# EAGLE design main (EAGLE 6.6.0)
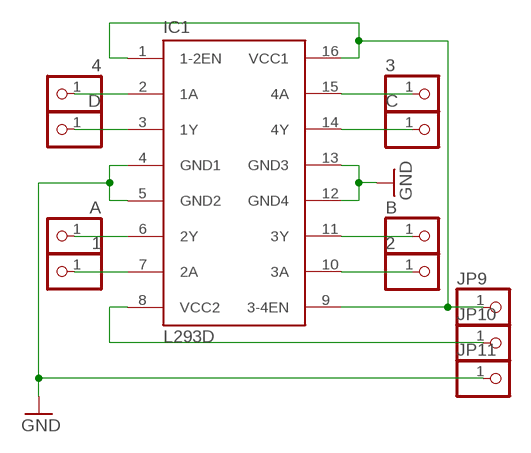
[diagram p0: schematic, sheet 1]

## Parts
1  PINHD-1X1  [1X01]
2  PINHD-1X1  [1X01]
3  PINHD-1X1  [1X01]
4  PINHD-1X1  [1X01]
A  PINHD-1X1  [1X01]
B  PINHD-1X1  [1X01]
C  PINHD-1X1  [1X01]
D  PINHD-1X1  [1X01]
IC1  L293D  [DIL16]
JP9  PINHD-1X1  [1X01]
JP10  PINHD-1X1  [1X01]
JP11  PINHD-1X1  [1X01]

## Nets
GND: IC1.4(GND1) IC1.5(GND2) IC1.12(GND4) IC1.13(GND3) JP11.1
N$1: IC1.1(1-2EN) IC1.9(3-4EN) IC1.16(VCC1) JP9.1
N$2: IC1.8(VCC2) JP10.1
N$3: 1.1 IC1.7(2A)
N$4: A.1 IC1.6(2Y)
N$5: D.1 IC1.3(1Y)
N$6: 4.1 IC1.2(1A)
N$7: 3.1 IC1.15(4A)
N$8: C.1 IC1.14(4Y)
N$9: B.1 IC1.11(3Y)
N$10: 2.1 IC1.10(3A)

## Library data of the parts
1-4 A B C D JP9-JP11 = pinhead:PINHD-1X1: PIN HEADER
IC1 = st-microelectronics:L293D: PUSH-PULL 4 CHANNEL DRIVER; MPN: L293D; OC_FARNELL: 9589619; OC_NEWARK: 56P8249

## Board
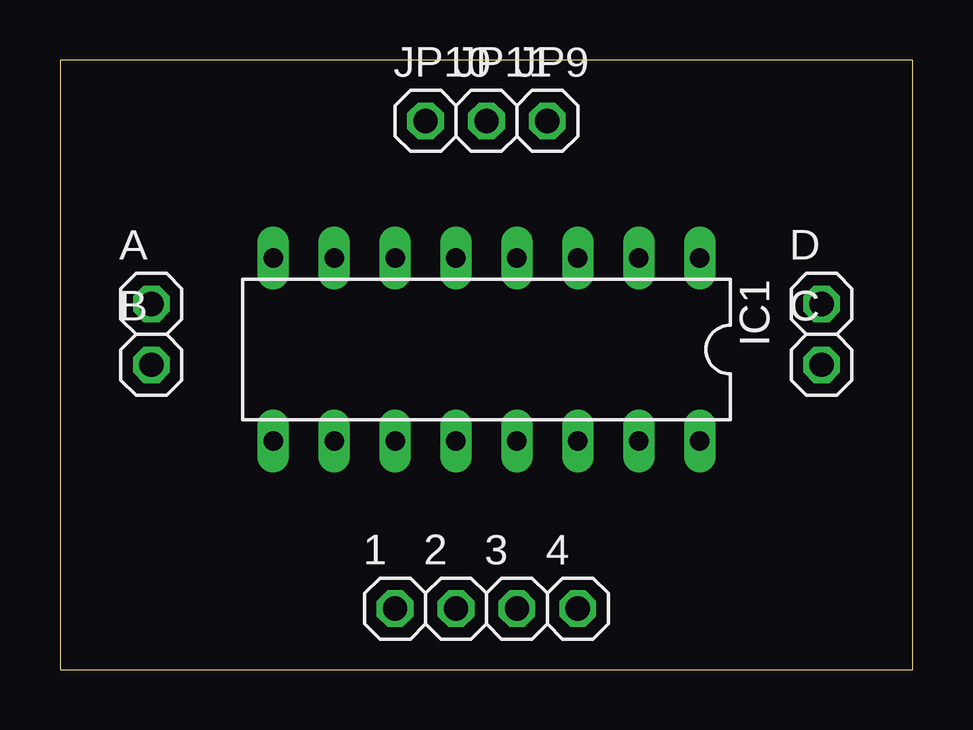
[diagram p1: board, top side]
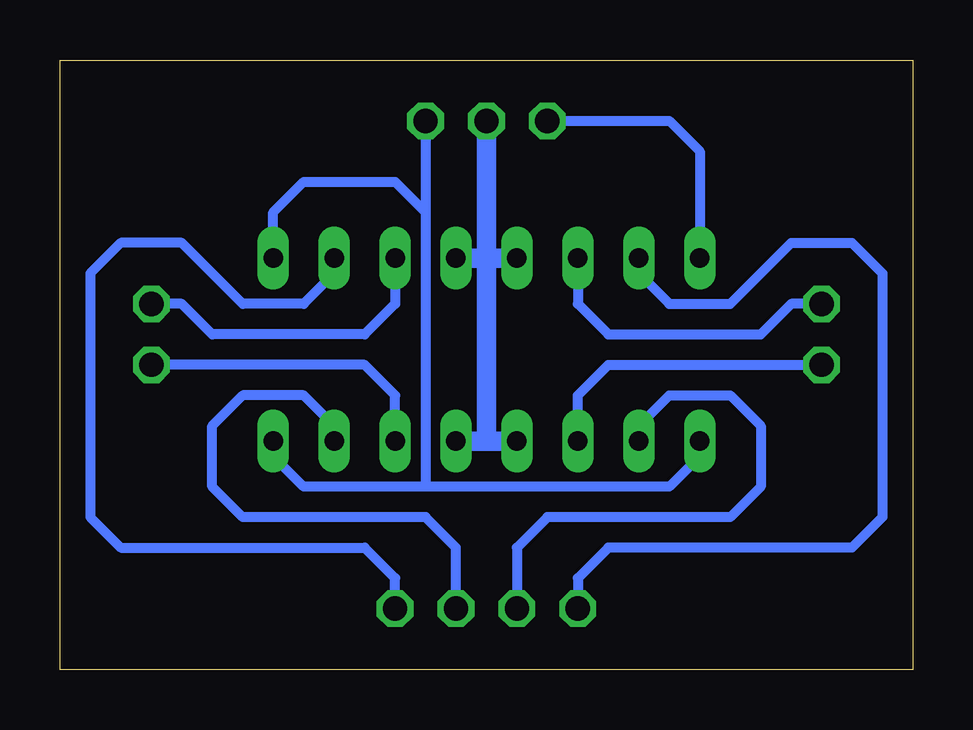
[diagram p2: board, bottom side, seen from below]

Size 35.56 x 25.4 mm. Coordinates in mm from the lower left corner, seen from the top.
Outline: 0,0 35.56,0 35.56,25.4 0,25.4 0,0
Copper layers (1*16): Top 0.035mm / dielectric 1.5mm / Bottom 0.035mm
Design rules "default": minimum track width 10mil, minimum drill 24mil, track to track 8mil, track to pad 8mil, pad to pad 8mil, via to via 8mil, smd to smd 8mil, copper to edge 40mil, drill to drill 8mil, minimum pad ring 10mil, minimum via ring 8mil, stop-mask expansion 4mil, vias tented up to drill 0mil, thermal gap 10mil

### Footprints (pad centres in the part's own frame; a part is rotated, then mirrored left to right if it is on the bottom)
1X01 = drill 1.016 octagon: 1 0,0
DIL16 = drill 0.813 long: 1 -8.89,-3.81; 2 -6.35,-3.81; 3 -3.81,-3.81; 4 -1.27,-3.81; 5 1.27,-3.81; 6 3.81,-3.81; 7 6.35,-3.81; 8 8.89,-3.81; 9 8.89,3.81; 10 6.35,3.81; 11 3.81,3.81; 12 1.27,3.81; 13 -1.27,3.81; 14 -3.81,3.81; 15 -6.35,3.81; 16 -8.89,3.81

### Placement (x,y rotation side)
1  13.97,2.54 0 top
2  16.51,2.54 0 top
3  19.05,2.54 0 top
4  21.59,2.54 0 top
A  3.81,15.24 0 top
B  3.81,12.7 0 top
C  31.75,12.7 0 top
D  31.75,15.24 0 top
IC1  17.78,13.34 180 top
JP9  20.32,22.86 0 top
JP10  15.24,22.86 0 top
JP11  17.78,22.86 0 top

### Tracks (layer width: path | path; a pad name or v marks a point on that pad's centre or on a via)
GND
  Bottom 0.813: IC1.12 17.78,9.53 | 18.41,9.53 IC1.13 17.78,9.53 | IC1.5 17.78,17.14 | 17.78,17.14 IC1.4 | 17.78,9.53 17.78,17.14 | JP11.1 17.78,17.14
N$1
  Bottom 0.406: IC1.9 8.89,8.89 10.16,7.62 20.32,7.62 | 20.32,7.62 25.4,7.62 26.67,8.89 IC1.16 | IC1.1 26.67,19.05 25.4,20.32 21.59,20.32 20.32,19.05 | 20.32,19.05 20.32,7.62 | JP9.1 20.32,19.05
N$2
  Bottom 0.406: JP10.1 10.16,22.86 8.89,21.59 IC1.8
N$3
  Bottom 0.406: IC1.7 11.43,16.51 10.16,15.24 7.62,15.24 5.08,17.78 2.54,17.78 1.27,16.51 1.27,6.35 2.54,5.08 12.7,5.08 13.97,3.81 1.1
N$4
  Bottom 0.406: IC1.6 13.97,15.24 12.7,13.97 6.35,13.97 5.08,15.24 A.1
N$5
  Bottom 0.406: IC1.3 21.59,15.24 22.86,13.97 29.21,13.97 30.48,15.24 D.1
N$6
  Bottom 0.406: IC1.2 24.13,16.51 25.4,15.24 27.94,15.24 30.48,17.78 33.02,17.78 34.29,16.51 34.29,6.35 33.02,5.08 22.86,5.08 21.59,3.81 4.1
N$7
  Bottom 0.406: IC1.15 24.13,10.16 25.4,11.43 27.94,11.43 29.21,10.16 29.21,7.62 27.94,6.35 20.32,6.35 19.05,5.08 3.1
N$8
  Bottom 0.406: IC1.14 21.59,11.43 22.86,12.7 C.1
N$9
  Bottom 0.406: IC1.11 13.97,11.43 12.7,12.7 B.1
N$10
  Bottom 0.406: IC1.10 11.43,10.16 10.16,11.43 7.62,11.43 6.35,10.16 6.35,7.62 7.62,6.35 15.24,6.35 16.51,5.08 2.1